# EAGLE design DUCO Miner 16-01 (EAGLE 9.6.2)
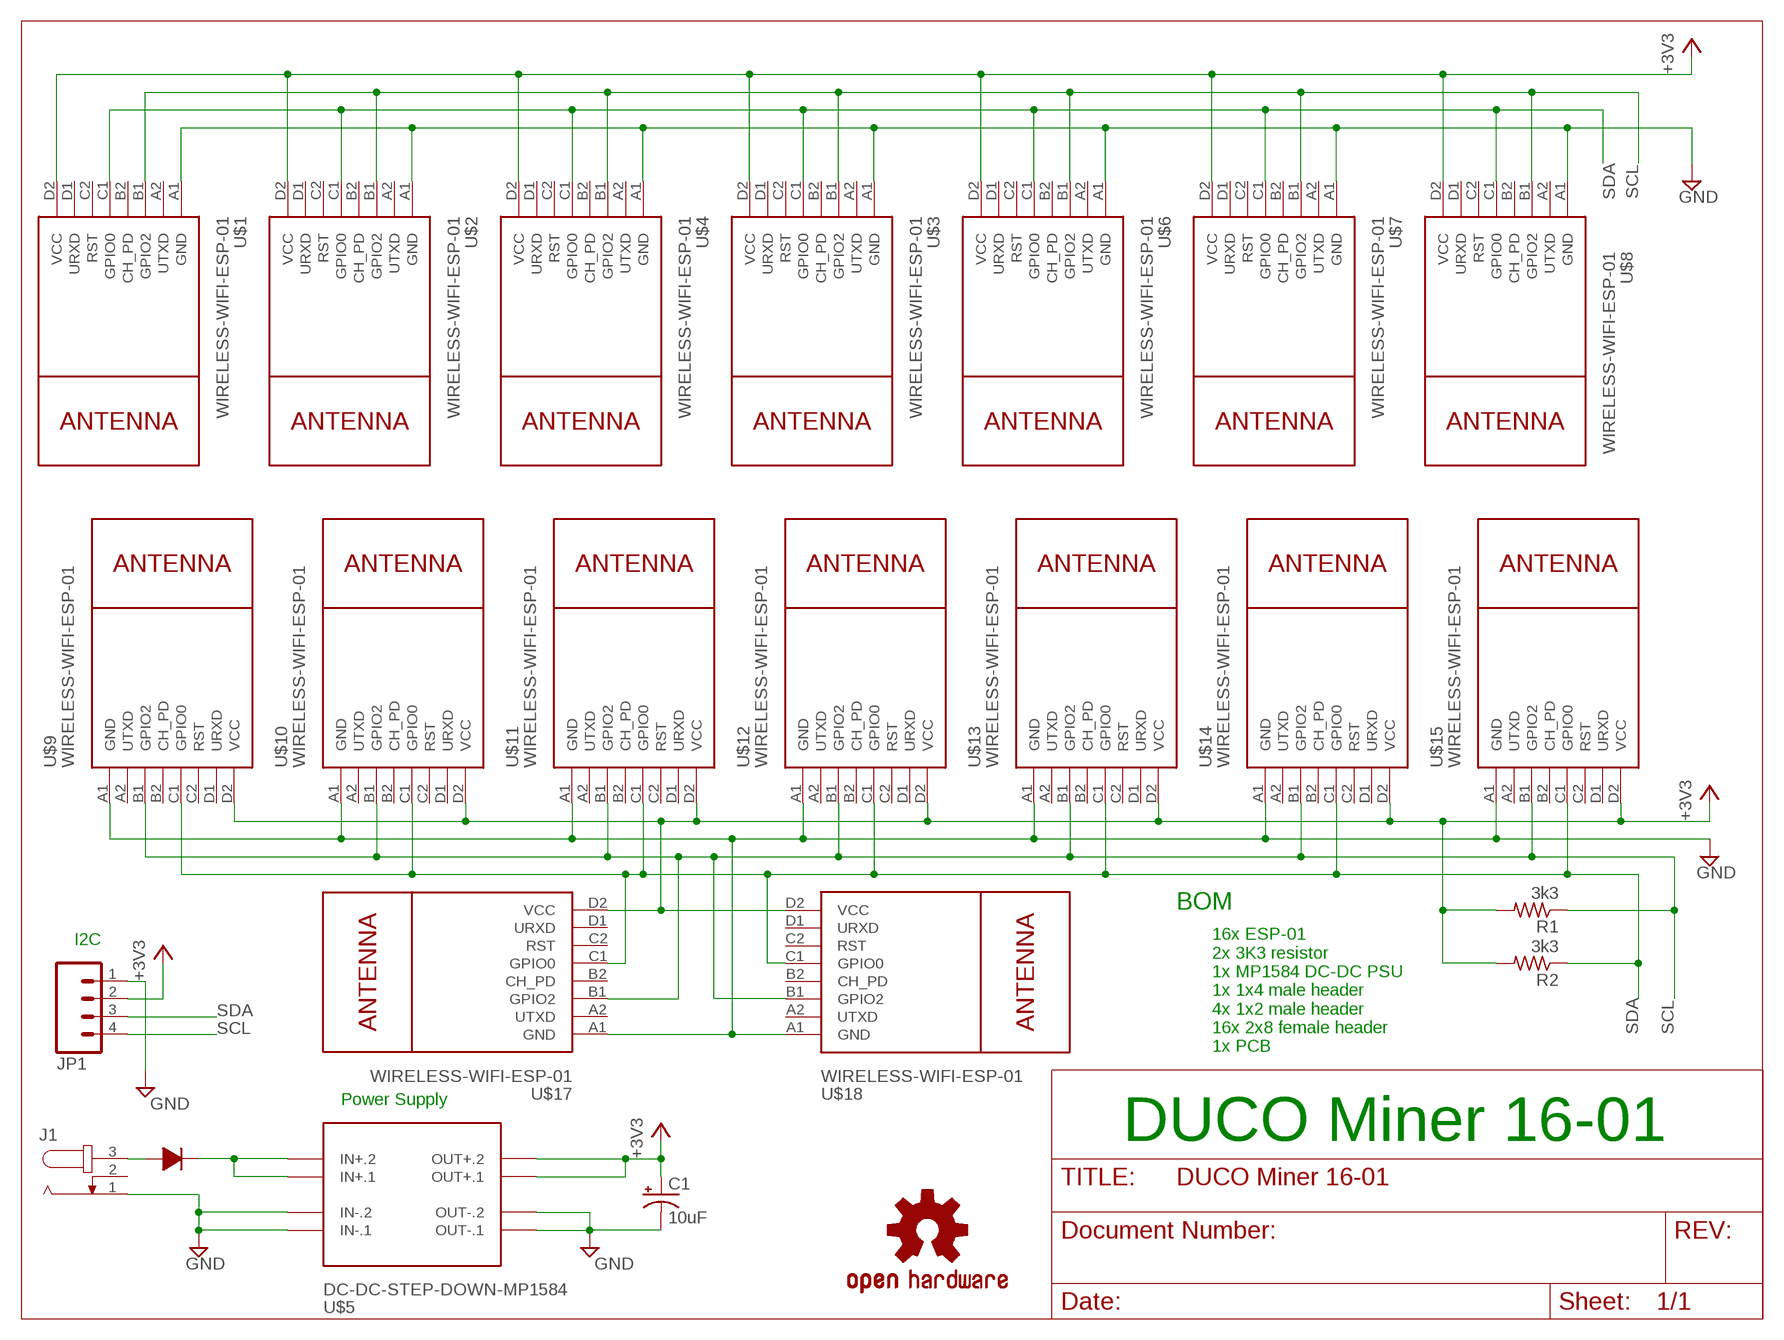
[diagram p0: schematic, sheet 1]

## Parts
C1  10uF  CPOL-USE2-5  [E2-5]
J1  JACK-PLUG0  [SPC4077]
JP1  M04PTH  [1X04]
LOGO1  OSHW-LOGOL  [OSHW-LOGO-L]
R1  3k3  R-US_0204/7  [0204/7]
R2  3k3  R-US_0204/7  [0204/7]
U$1  WIRELESS-WIFI-ESP-01  [WIRELESS-WIFI-ESP-01]
U$2  WIRELESS-WIFI-ESP-01  [WIRELESS-WIFI-ESP-01]
U$3  WIRELESS-WIFI-ESP-01  [WIRELESS-WIFI-ESP-01]
U$4  WIRELESS-WIFI-ESP-01  [WIRELESS-WIFI-ESP-01]
U$5  DC-DC-STEP-DOWN-MP1584  [DC-DC-STEP-DOWN-MP1584]
U$6  WIRELESS-WIFI-ESP-01  [WIRELESS-WIFI-ESP-01]
U$7  WIRELESS-WIFI-ESP-01  [WIRELESS-WIFI-ESP-01]
U$8  WIRELESS-WIFI-ESP-01  [WIRELESS-WIFI-ESP-01]
U$9  WIRELESS-WIFI-ESP-01  [WIRELESS-WIFI-ESP-01]
U$10  WIRELESS-WIFI-ESP-01  [WIRELESS-WIFI-ESP-01]
U$11  WIRELESS-WIFI-ESP-01  [WIRELESS-WIFI-ESP-01]
U$12  WIRELESS-WIFI-ESP-01  [WIRELESS-WIFI-ESP-01]
U$13  WIRELESS-WIFI-ESP-01  [WIRELESS-WIFI-ESP-01]
U$14  WIRELESS-WIFI-ESP-01  [WIRELESS-WIFI-ESP-01]
U$15  WIRELESS-WIFI-ESP-01  [WIRELESS-WIFI-ESP-01]
U$16  1N4001  [DIODE-12.70]
U$17  WIRELESS-WIFI-ESP-01  [WIRELESS-WIFI-ESP-01]
U$18  WIRELESS-WIFI-ESP-01  [WIRELESS-WIFI-ESP-01]

## Nets
+3V3: C1.+ JP1.2 R1.2 R2.2 U$1.D2(VCC) U$2.D2(VCC) U$3.D2(VCC) U$4.D2(VCC) U$5.OUT+.1 U$5.OUT+.2 U$6.D2(VCC) U$7.D2(VCC) U$8.D2(VCC) U$9.D2(VCC) U$10.D2(VCC) U$11.D2(VCC) U$12.D2(VCC) U$13.D2(VCC) U$14.D2(VCC) U$15.D2(VCC) U$17.D2(VCC) U$18.D2(VCC)
GND: C1.- J1.1 JP1.1 U$1.A1(GND) U$2.A1(GND) U$3.A1(GND) U$4.A1(GND) U$5.IN-.1 U$5.IN-.2 U$5.OUT-.1 U$5.OUT-.2 U$6.A1(GND) U$7.A1(GND) U$8.A1(GND) U$9.A1(GND) U$10.A1(GND) U$11.A1(GND) U$12.A1(GND) U$13.A1(GND) U$14.A1(GND) U$15.A1(GND) U$17.A1(GND) U$18.A1(GND)
N$1: J1.3 U$16.P$1
N$3: U$5.IN+.1 U$5.IN+.2 U$16.P$2
SCL: JP1.4 R1.1 U$1.B1(GPIO2) U$2.B1(GPIO2) U$3.B1(GPIO2) U$4.B1(GPIO2) U$6.B1(GPIO2) U$7.B1(GPIO2) U$8.B1(GPIO2) U$9.B1(GPIO2) U$10.B1(GPIO2) U$11.B1(GPIO2) U$12.B1(GPIO2) U$13.B1(GPIO2) U$14.B1(GPIO2) U$15.B1(GPIO2) U$17.B1(GPIO2) U$18.B1(GPIO2)
SDA: JP1.3 R2.1 U$1.C1(GPIO0) U$2.C1(GPIO0) U$3.C1(GPIO0) U$4.C1(GPIO0) U$6.C1(GPIO0) U$7.C1(GPIO0) U$8.C1(GPIO0) U$9.C1(GPIO0) U$10.C1(GPIO0) U$11.C1(GPIO0) U$12.C1(GPIO0) U$13.C1(GPIO0) U$14.C1(GPIO0) U$15.C1(GPIO0) U$17.C1(GPIO0) U$18.C1(GPIO0)
Unconnected: J1.2 U$1.A2(UTXD) U$1.B2(CH_PD) U$1.C2(RST) U$1.D1(URXD) U$2.A2(UTXD) U$2.B2(CH_PD) U$2.C2(RST) U$2.D1(URXD) U$3.A2(UTXD) U$3.B2(CH_PD) U$3.C2(RST) U$3.D1(URXD) U$4.A2(UTXD) U$4.B2(CH_PD) U$4.C2(RST) U$4.D1(URXD) U$6.A2(UTXD) U$6.B2(CH_PD) U$6.C2(RST) U$6.D1(URXD) U$7.A2(UTXD) U$7.B2(CH_PD) U$7.C2(RST) U$7.D1(URXD) U$8.A2(UTXD) U$8.B2(CH_PD) U$8.C2(RST) U$8.D1(URXD) U$9.A2(UTXD) U$9.B2(CH_PD) U$9.C2(RST) U$9.D1(URXD) U$10.A2(UTXD) U$10.B2(CH_PD) U$10.C2(RST) U$10.D1(URXD) U$11.A2(UTXD) U$11.B2(CH_PD) U$11.C2(RST) U$11.D1(URXD) U$12.A2(UTXD) U$12.B2(CH_PD) U$12.C2(RST) U$12.D1(URXD) U$13.A2(UTXD) U$13.B2(CH_PD) U$13.C2(RST) U$13.D1(URXD) U$14.A2(UTXD) U$14.B2(CH_PD) U$14.C2(RST) U$14.D1(URXD) U$15.A2(UTXD) U$15.B2(CH_PD) U$15.C2(RST) U$15.D1(URXD) U$17.A2(UTXD) U$17.B2(CH_PD) U$17.C2(RST) U$17.D1(URXD) U$18.A2(UTXD) U$18.B2(CH_PD) U$18.C2(RST) U$18.D1(URXD)

## Notes on the sheet
- BOM
- I2C
- 16x ESP-01
  2x 3K3 resistor
  1x MP1584 DC-DC PSU
  1x 1x4 male header
  4x 1x2 male header
  16x 2x8 female header
  1x PCB
- Power Supply
- DUCO Miner 16-01

## Library data of the parts
C1 = rcl:CPOL-US: POLARIZED CAPACITOR, American symbol; SPICEPREFIX: C
J1 = con-jack:JACK-PLUG: DC POWER JACK Power Jack, DC, Right Angle, Through Hole, Rated 5A at 16VDC, PC Terminals Distributor: Farnell (www.Farnell.de) Drawing: 84N1161.pdf / 84N1162.pdf Manufacturer: SPC Technology (www.spctechnology.com) Type: SPC4077 / SPC 4078; OC_FARNELL: unknown; OC_NEWARK: unknown
JP1 = SparkFun:M04: Header 4 Standard 4-pin 0.1" header. Use with straight break away headers (SKU : PRT-00116), right angle break away headers (PRT-00553), swiss pins (PRT-00743), machine pins (PRT-00117), and female headers (PRT-00115). Molex polarized connector foot print use with SKU : PRT-08231 with associated crimp pins and housings. 1MM SMD Version SKU: PRT-10208
LOGO1 = SparkFun-Aesthetics:OSHW-LOGO: Open Source Hardware Logo This logo indicates the piece of hardware it is found on incorporates a OSHW license and/or adheres to the definition of open source hardware found here: http://freedomdefined.org/OSHW
R1 R2 = rcl:R-US_: RESISTOR, American symbol; SPICEPREFIX: R
U$1-U$4 U$6-U$15 U$17 U$18 = diy-modules:WIRELESS-WIFI-ESP-01: Wireless Wi-Fi ESP-01 Module based on ESP8266 chip Click here to find device on ebay.com <http://www.ebay.com/sch/esp8266+esp+01+transceiver>
U$5 = diy-modules:DC-DC-STEP-DOWN-MP1584: DC/DC Step-Down Regulator based on MP1584 chip MP1584 datasheet available here: http://www.haoyuelectronics.com/Attachment/MP1584/MP1584.pdf Click here to find device on ebay.com <http://www.ebay.com/sch/mp1584+module>
U$16 = Oles komponentbibliotek:1N4001: 1N4001 diode

## Board
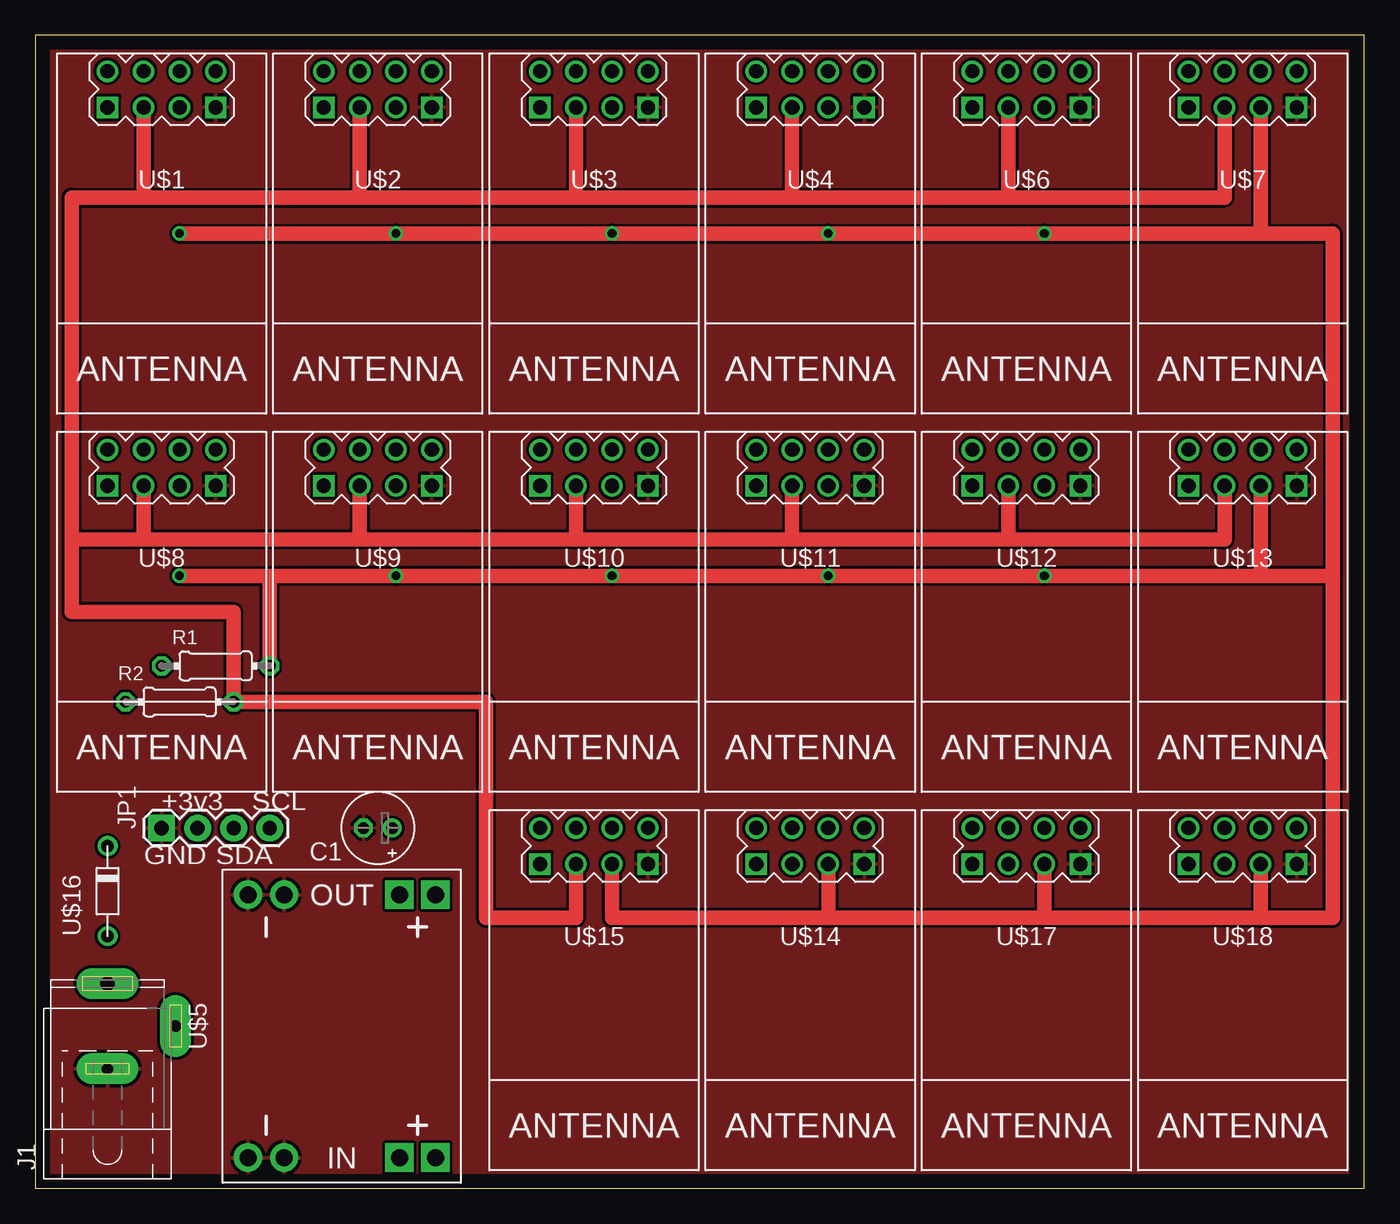
[diagram p1: board, top side]
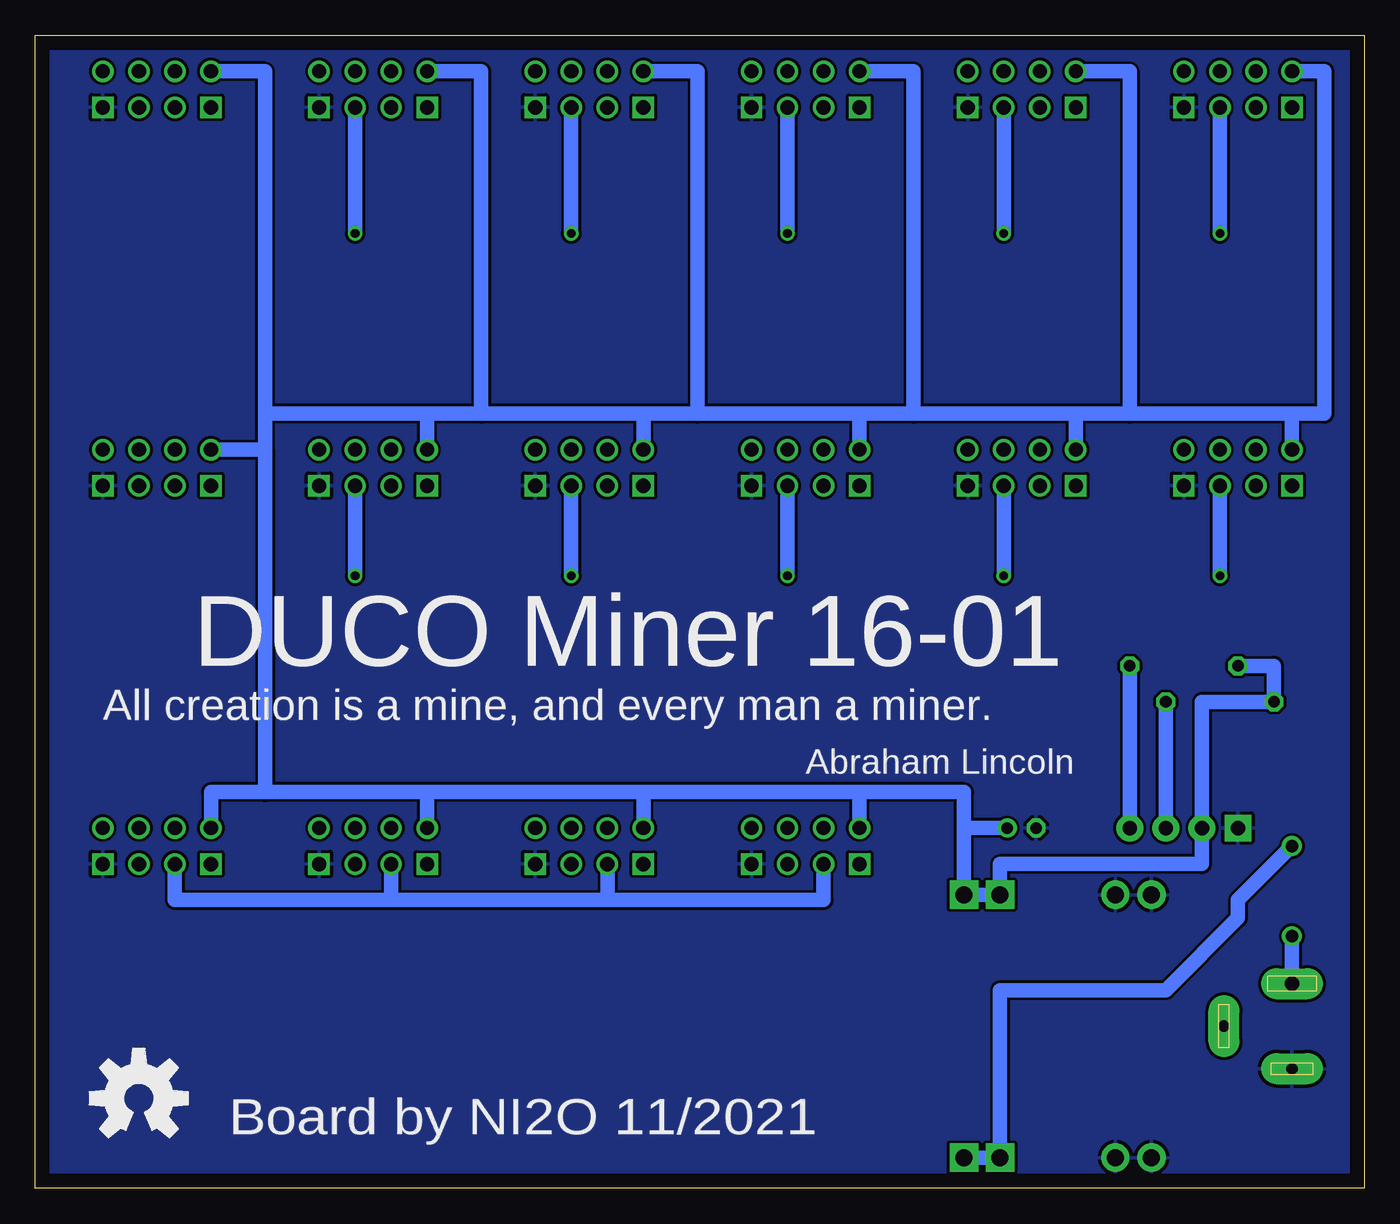
[diagram p2: board, bottom side, seen from below]

Size 93.65 x 81.27 mm. Coordinates in mm from the lower left corner, seen from the top.
Outline: 0,0 93.65,0 93.65,81.27 0,81.27 0,0
Copper layers (1*16): Top 0.035mm / dielectric 1.5mm / Bottom 0.035mm
Design rules "default": minimum track width 10mil, minimum drill 24mil, track to track 8mil, track to pad 8mil, pad to pad 8mil, via to via 8mil, smd to smd 8mil, copper to edge 40mil, drill to drill 8mil, minimum pad ring 10mil, minimum via ring 8mil, stop-mask expansion 4mil, vias tented up to drill 0mil, thermal gap 10mil

### Footprints (pad centres in the part's own frame; a part is rotated, then mirrored left to right if it is on the bottom)
E2-5 = drill 0.813 pad 1.27: + -1.016,0 | drill 0.813 pad 1.27 octagon: - 1.016,0
SPC4077 = drill 0.8 pad 2.184 long: 1 -3,0; 2 0,-4.8 | drill 1 pad 2.184 long: 3 3,0
1X04 = drill 1.016 pad 1.88 square: 1 0,0 | drill 1.016 pad 1.88: 2 2.54,0; 3 5.08,0; 4 7.62,0
0204/7 = drill 0.813 octagon: 1 -3.81,0; 2 3.81,0
WIRELESS-WIFI-ESP-01 = drill 1 square: A1 -8.89,3.81; D1 -8.89,-3.81 | drill 1: A2 -11.43,3.81; B1 -8.89,1.27; B2 -11.43,1.27; C1 -8.89,-1.27; C2 -11.43,-1.27; D2 -11.43,-3.81
DC-DC-STEP-DOWN-MP1584 = drill 1.2 pad 2 square: IN+.1 -9.271,-4.064; IN+.2 -9.271,-6.604; OUT+.1 9.271,-4.064; OUT+.2 9.271,-6.604 | drill 1.2 pad 2: IN-.1 -9.271,6.604; IN-.2 -9.271,4.064; OUT-.1 9.271,6.604; OUT-.2 9.271,4.064
DIODE-12.70 = drill 0.9: P$1 -3.81,0; P$2 2.54,0

### Placement (x,y rotation side)
C1  24.13,25.4 180 top
J1  5.08,11.43 90 top
JP1  8.89,25.4 0 top
LOGO1  86.36,6.35 0 bottom
R1  12.7,36.83 180 top
R2  10.16,34.29 180 top
U$1  8.89,67.31 270 top
U$2  24.13,67.31 270 top
U$3  39.37,67.31 270 top
U$4  54.61,67.31 270 top
U$5  21.59,11.43 90 top
U$6  69.85,67.31 270 top
U$7  85.09,67.31 270 top
U$8  8.89,40.64 270 top
U$9  24.13,40.64 270 top
U$10  39.37,40.64 270 top
U$11  54.61,40.64 270 top
U$12  69.85,40.64 270 top
U$13  85.09,40.64 270 top
U$14  54.61,13.97 270 top
U$15  39.37,13.97 270 top
U$16  5.08,21.59 90 top
U$17  69.85,13.97 270 top
U$18  85.09,13.97 270 top

### Tracks (layer width: path | path; a pad name or v marks a point on that pad's centre or on a via)
+3V3
  Bottom 1.016: 28.19,25.4 U$5.OUT+.2 U$5.OUT+.1 25.65,22.86 11.43,22.86 JP1.2 11.43,34.29 R2.2 6.35,36.83 R1.2 | 28.19,25.4 28.19,27.94 35.56,27.94 | U$18.D2 81.28,27.94 77.47,27.94 | 35.56,27.94 50.8,27.94 | 50.8,27.94 66.04,27.94 | 66.04,27.94 77.47,27.94 | U$17.D2 66.04,27.94 | U$14.D2 50.8,27.94 | U$15.D2 35.56,27.94 | U$13.D2 77.47,52.07 | 77.47,52.07 77.47,27.94 | 77.47,52.07 77.47,54.61 | U$12.D2 66.04,54.61 | 66.04,54.61 77.47,54.61 | U$8.D2 5.08,54.61 | 5.08,54.61 16.51,54.61 | 16.51,54.61 20.32,54.61 | 20.32,54.61 31.75,54.61 | 31.75,54.61 35.56,54.61 | 35.56,54.61 46.99,54.61 | 46.99,54.61 50.8,54.61 | 50.8,54.61 62.23,54.61 | 62.23,54.61 66.04,54.61 | U$9.D2 20.32,54.61 | U$10.D2 35.56,54.61 | U$11.D2 50.8,54.61 | U$7.D2 77.47,78.74 77.47,54.61 | U$6.D2 62.23,78.74 62.23,54.61 | U$4.D2 46.99,78.74 46.99,54.61 | U$3.D2 31.75,78.74 31.75,54.61 | U$2.D2 16.51,78.74 16.51,54.61 | U$1.D2 2.79,78.74 2.79,54.61 5.08,54.61 | C1.+ 28.19,25.4
GND
  pour Top: 0,0 0,81.28 93.98,81.28 93.98,0
  pour Bottom: 0,0 0,81.28 93.98,81.28 93.98,0
N$1
  Bottom 1.016: U$16.P$1 J1.3
N$3
  Bottom 1.016: U$5.IN+.2 U$5.IN+.1 25.65,13.97 13.97,13.97 8.89,19.05 8.89,20.32 U$16.P$2
SCL  (via drill 0.61)
  Top 1.016: U$18.B1 86.36,19.05 | 86.36,19.05 71.12,19.05 | 71.12,19.05 55.88,19.05 | 55.88,19.05 40.64,19.05 U$15.B1 | U$14.B1 55.88,19.05 | U$17.B1 71.12,19.05 | 16.51,43.18 v25.4,43.18 v40.64,43.18 v55.88,43.18 v71.12,43.18 86.36,43.18 | U$13.B1 86.36,43.18 | 86.36,19.05 91.44,19.05 91.44,43.18 | 91.44,43.18 86.36,43.18 | U$7.B1 86.36,67.31 | 86.36,67.31 91.44,67.31 91.44,43.18 | v10.16,67.31 v25.4,67.31 v40.64,67.31 v55.88,67.31 v71.12,67.31 86.36,67.31 | v10.16,43.18 16.51,43.18 | R1.1 16.51,43.18
  Bottom 1.016: U$12.B1 v71.12,43.18 | v10.16,43.18 U$8.B1 | U$9.B1 v25.4,43.18 | U$10.B1 v40.64,43.18 | U$11.B1 v55.88,43.18 | U$1.B1 v10.16,67.31 | U$2.B1 v25.4,67.31 | U$3.B1 v40.64,67.31 | U$4.B1 v55.88,67.31 | U$6.B1 v71.12,67.31 | R1.1 JP1.4
SDA
  Top 1.016: U$15.C1 38.1,19.05 31.75,19.05 31.75,34.29 R2.1 13.97,40.64 2.54,40.64 2.54,45.72 | U$1.C1 7.62,69.85 | 7.62,69.85 22.86,69.85 | 22.86,69.85 38.1,69.85 | 38.1,69.85 53.34,69.85 | 53.34,69.85 68.58,69.85 | 68.58,69.85 83.82,69.85 U$7.C1 | U$2.C1 22.86,69.85 | U$3.C1 38.1,69.85 | U$4.C1 53.34,69.85 | U$6.C1 68.58,69.85 | 7.62,45.72 2.54,45.72 | 2.54,45.72 2.54,69.85 7.62,69.85 | U$13.C1 83.82,45.72 68.58,45.72 | 7.62,45.72 U$8.C1 | 68.58,45.72 53.34,45.72 | 53.34,45.72 38.1,45.72 | 38.1,45.72 22.86,45.72 | 22.86,45.72 7.62,45.72 | U$9.C1 22.86,45.72 | U$10.C1 38.1,45.72 | U$11.C1 53.34,45.72 | U$12.C1 68.58,45.72
  Bottom 1.016: U$18.C1 83.82,20.32 68.58,20.32 | U$15.C1 38.1,20.32 53.34,20.32 | 68.58,20.32 53.34,20.32 | U$14.C1 53.34,20.32 | U$17.C1 68.58,20.32 | JP1.3 R2.1

### Text on the board
tNames: +3v3 | SCL | GND | SDA
bNames: DUCO Miner 16-01 | All creation is a mine, and every man a miner. | Abraham Lincoln | Board by NI2O 11/2021